# Altium schematic sheet PIC32.SchDoc: Carte mère embarquée - PIC32
size A3; Author: B Labbe; CompanyName: Oufffteam; DrawnBy: B Labbe; Engineer: B Labbe; Organization: Oufffteam; Address1: L3, 12a Rodborough Rd; Address2: Frenchs Forest; Address3: NSW; Address4: Australia 2086; Revision: A; SheetNumber: 3; SheetTotal: 6; DocumentName: Carte mère embarquée - PIC32
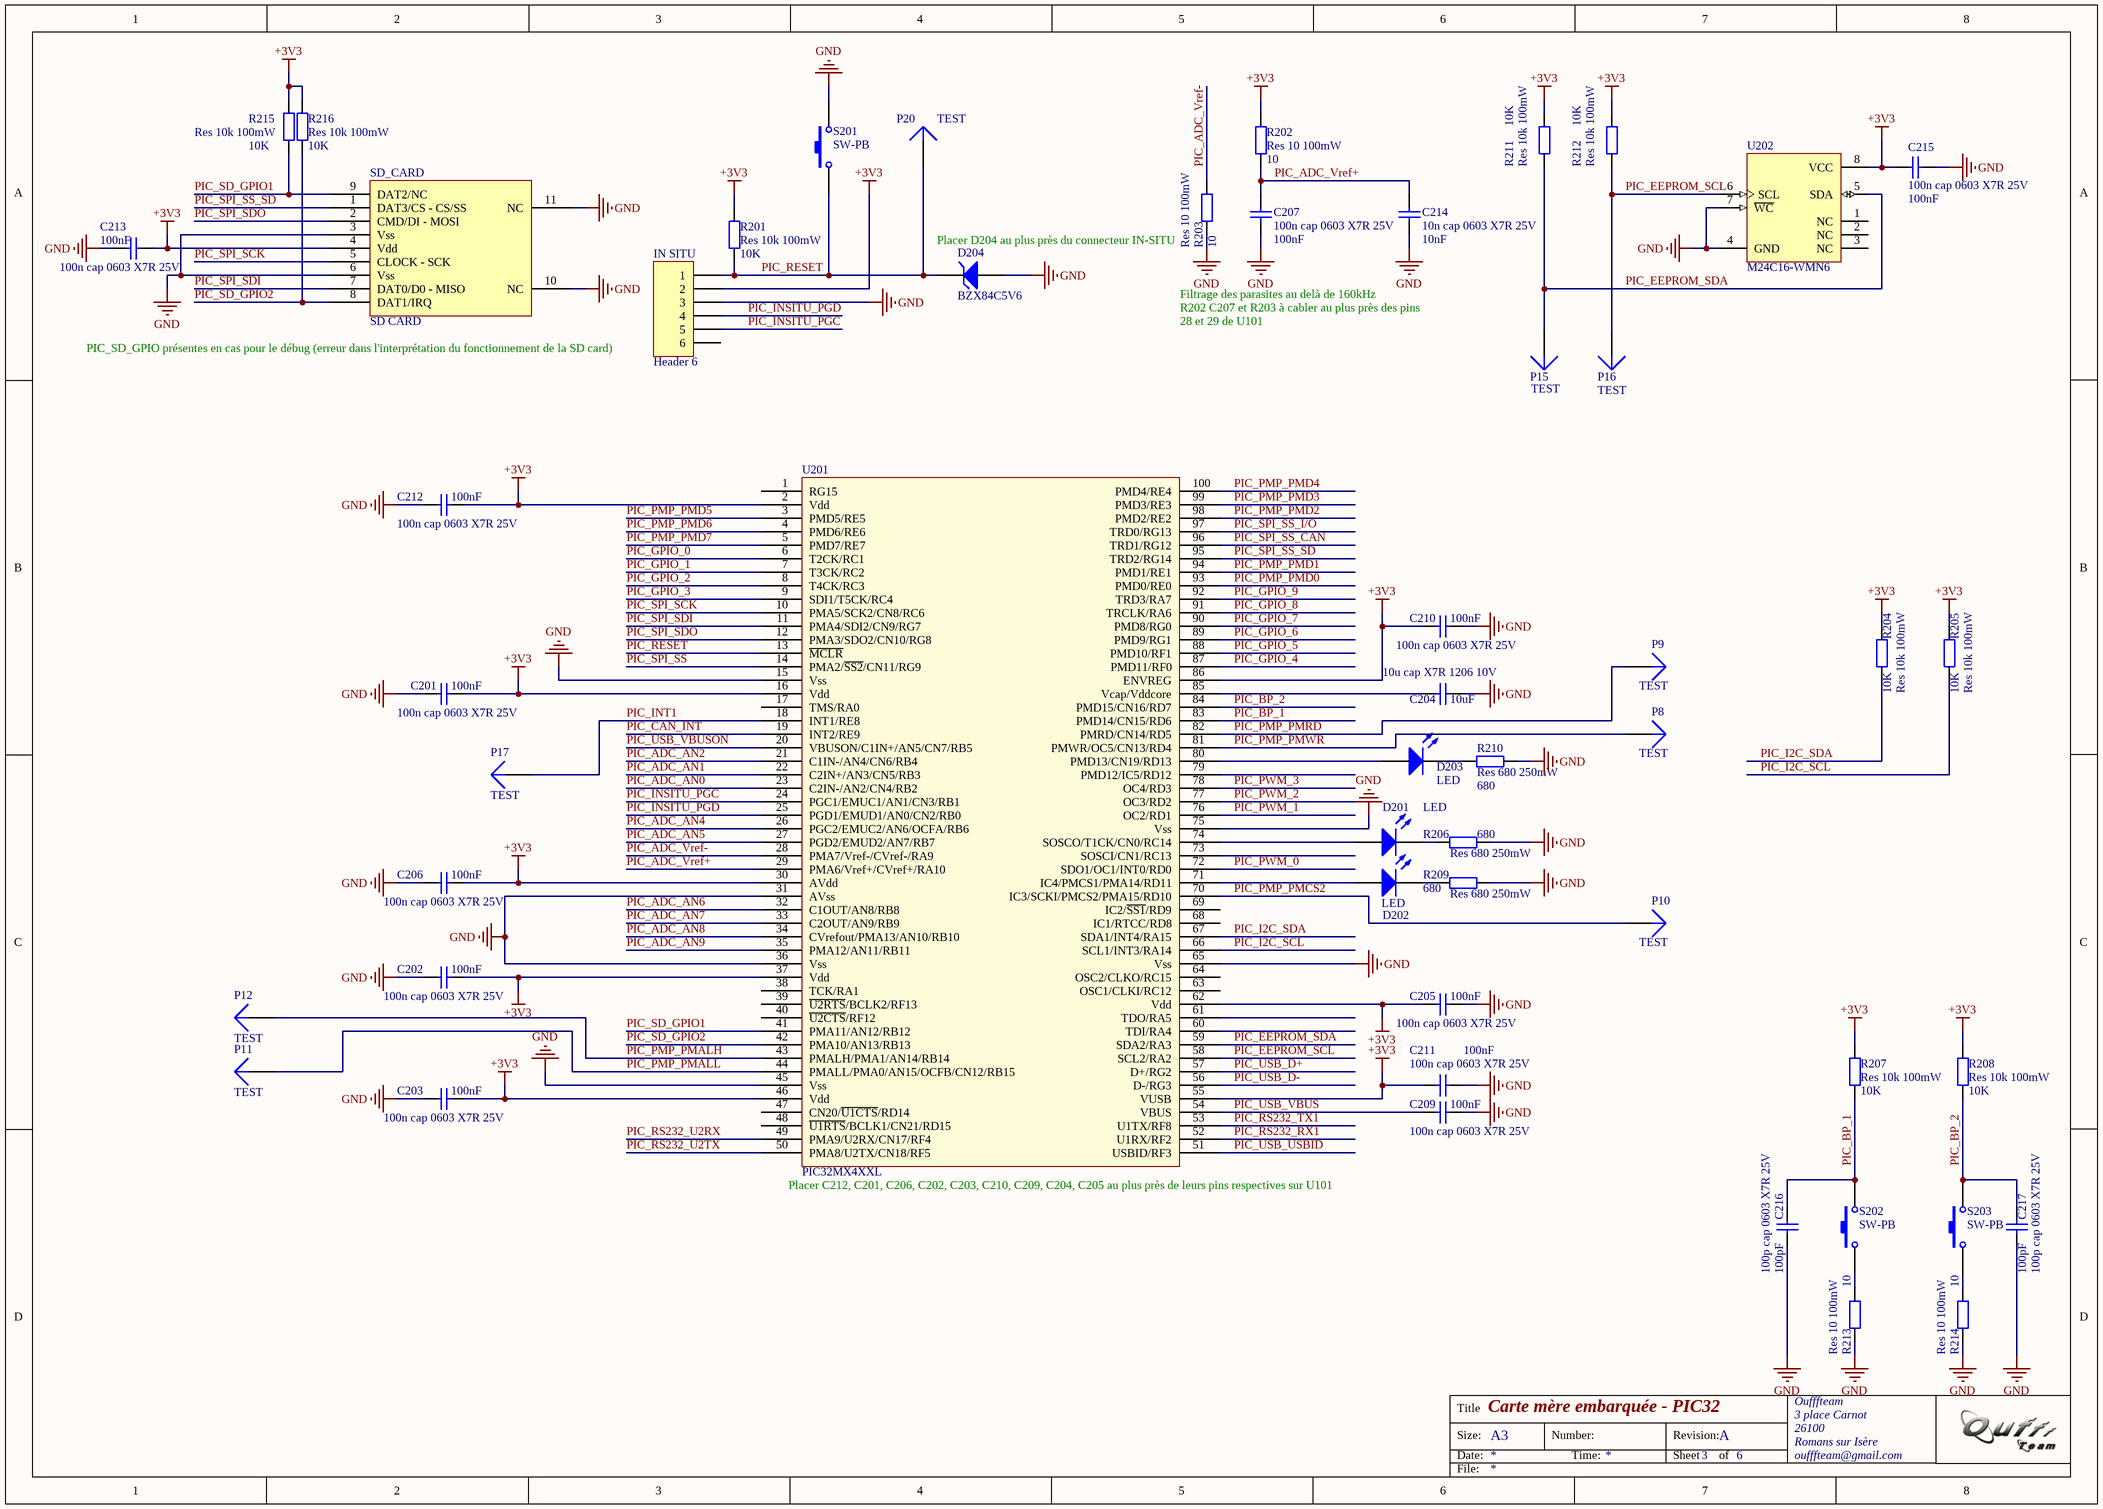
[diagram p0: PIC32.SchDoc]

## Parts
C201  100n cap 0603 X7R 25V  value 100nF  [1608[0603]]
C202  100n cap 0603 X7R 25V  value 100nF  [1608[0603]]
C203  100n cap 0603 X7R 25V  value 100nF  [1608[0603]]
C204  10u cap X7R 1206 10V  value 10uF  [3216[1206]]
C205  100n cap 0603 X7R 25V  value 100nF  [1608[0603]]
C206  100n cap 0603 X7R 25V  value 100nF  [1608[0603]]
C207  100n cap 0603 X7R 25V  value 100nF  [1608[0603]]
C209  100n cap 0603 X7R 25V  value 100nF  [1608[0603]]
C210  100n cap 0603 X7R 25V  value 100nF  [1608[0603]]
C211  100n cap 0603 X7R 25V  value 100nF  [1608[0603]]
C212  100n cap 0603 X7R 25V  value 100nF  [1608[0603]]
C213  100n cap 0603 X7R 25V  value 100nF  [1608[0603]]
C214  10n cap 0603 X7R 25V  value 10nF  [1608[0603]]
C215  100n cap 0603 X7R 25V  value 100nF  [1608[0603]]
C216  100p cap 0603 X7R 25V  value 100pF  [1608[0603]]
C217  100p cap 0603 X7R 25V  value 100pF  [1608[0603]]
D201  LED  [1608[0603]]
D202  LED  [1608[0603]]
D203  LED  [1608[0603]]
D204  BZX84C5V6  [318-07]
IN_SITU  Header 6  [HDR1X6]
P8  TEST  [TP1]
P9  TEST  [TP1]
P10  TEST  [TP1]
P11  TEST  [TP1]
P12  TEST  [TP1]
P15  TEST  [TP1]
P16  TEST  [TP1]
P17  TEST  [TP1]
P20  TEST  [TP1]
R201  Res 10k 100mW  value 10K  [1608[0603]]
R202  Res 10 100mW  value 10  [1608[0603]]
R203  Res 10 100mW  value 10  [1608[0603]]
R204  Res 10k 100mW  value 10K  [1608[0603]]
R205  Res 10k 100mW  value 10K  [1608[0603]]
R206  Res 680 250mW  value 680  [1608[0603]]
R207  Res 10k 100mW  value 10K  [1608[0603]]
R208  Res 10k 100mW  value 10K  [1608[0603]]
R209  Res 680 250mW  value 680  [1608[0603]]
R210  Res 680 250mW  value 680  [1608[0603]]
R211  Res 10k 100mW  value 10K  [1608[0603]]
R212  Res 10k 100mW  value 10K  [1608[0603]]
R213  Res 10 100mW  value 10  [1608[0603]]
R214  Res 10 100mW  value 10  [1608[0603]]
R215  Res 10k 100mW  value 10K  [1608[0603]]
R216  Res 10k 100mW  value 10K  [1608[0603]]
S201  SW-PB  [BP1]
S202  SW-PB  [BP1]
S203  SW-PB  [BP1]
SD_CARD  SD CARD  [SDHolder]
U201  PIC32MX4XXL  [TSQFP40P1400X1400X120-100N]
U202  M24C16-WMN6  [SOP8_N]

## Nets
+3V3: C201.2 C202.2 C203.2 C205.1 C206.2 C210.1 C211.1 C212.2 C213.2 C215.1 IN_SITU.2 R201.2 R202.2 R204.2 R205.2 R207.2 R208.2 R211.2 R212.2 R215.2 R216.2 SD_CARD.4(Vdd) U201.2(Vdd) U201.16(Vdd) U201.30(AVdd) U201.37(Vdd) U201.46(Vdd) U201.55(VUSB) U201.62(Vdd) U201.86(ENVREG) U202.8(VCC)
GND: C201.1 C202.1 C203.1 C204.2 C205.2 C206.1 C207.1 C209.2 C210.2 C211.2 C212.1 C213.1 C214.1 C215.2 C216.1 C217.1 D204.1(A) IN_SITU.3 R203.1 R206.2 R209.2 R210.2 R213.1 R214.1 S201.3 SD_CARD.3(Vss) SD_CARD.6(Vss) SD_CARD.10(NC) SD_CARD.11(NC) U201.15(Vss) U201.31(AVss) U201.36(Vss) U201.45(Vss) U201.65(Vss) U201.75(Vss) U202.4(GND) U202.7(~{WC})
PIC_ADC_AN0: U201.23(C2IN-/AN2/CN4/RB2)
PIC_ADC_AN1: U201.22(C2IN+/AN3/CN5/RB3)
PIC_ADC_AN2: U201.21(C1IN-/AN4/CN6/RB4)
PIC_ADC_AN4: U201.26(PGC2/EMUC2/AN6/OCFA/RB6)
PIC_ADC_AN5: U201.27(PGD2/EMUD2/AN7/RB7)
PIC_ADC_AN6: U201.32(C1OUT/AN8/RB8)
PIC_ADC_AN7: U201.33(C2OUT/AN9/RB9)
PIC_ADC_AN8: U201.34(CVrefout/PMA13/AN10/RB10)
PIC_ADC_AN9: U201.35(PMA12/AN11/RB11)
PIC_ADC_Vref+: C207.2 C214.2 R202.1 U201.29(PMA6/Vref+/CVref+/RA10)
PIC_ADC_Vref-: R203.2 U201.28(PMA7/Vref-/CVref-/RA9)
PIC_BP_1: C216.2 R207.1 S202.3 U201.83(PMD14/CN15/RD6)
PIC_BP_2: C217.2 R208.1 S203.3 U201.84(PMD15/CN16/RD7)
PIC_CAN_INT: U201.19(INT2/RE9)
PIC_EEPROM_SCL: P16.1 R212.1 U201.58(SCL2/RA2) U202.6(SCL)
PIC_EEPROM_SDA: P15.1 R211.1 U201.59(SDA2/RA3) U202.5(SDA)
PIC_GPIO_0: U201.6(T2CK/RC1)
PIC_GPIO_1: U201.7(T3CK/RC2)
PIC_GPIO_2: U201.8(T4CK/RC3)
PIC_GPIO_3: U201.9(SDI1/T5CK/RC4)
PIC_GPIO_4: U201.87(PMD11/RF0)
PIC_GPIO_5: U201.88(PMD10/RF1)
PIC_GPIO_6: U201.89(PMD9/RG1)
PIC_GPIO_7: U201.90(PMD8/RG0)
PIC_GPIO_8: U201.91(TRCLK/RA6)
PIC_GPIO_9: U201.92(TRD3/RA7)
PIC_I2C_SCL: R205.1 U201.66(SCL1/INT3/RA14)
PIC_I2C_SDA: R204.1 U201.67(SDA1/INT4/RA15)
PIC_INSITU_PGC: IN_SITU.5 U201.24(PGC1/EMUC1/AN1/CN3/RB1)
PIC_INSITU_PGD: IN_SITU.4 U201.25(PGD1/EMUD1/AN0/CN2/RB0)
PIC_INT1: P17.1 U201.18(INT1/RE8)
PIC_PMP_PMALH: P12.1 U201.43(PMALH/PMA1/AN14/RB14)
PIC_PMP_PMALL: P11.1 U201.44(PMALL/PMA0/AN15/OCFB/CN12/RB15)
PIC_PMP_PMCS2: P10.1 U201.70(IC3/SCKI/PMCS2/PMA15/RD10)
PIC_PMP_PMD0: U201.93(PMD0/RE0)
PIC_PMP_PMD1: U201.94(PMD1/RE1)
PIC_PMP_PMD2: U201.98(PMD2/RE2)
PIC_PMP_PMD3: U201.99(PMD3/RE3)
PIC_PMP_PMD4: U201.100(PMD4/RE4)
PIC_PMP_PMD5: U201.3(PMD5/RE5)
PIC_PMP_PMD6: U201.4(PMD6/RE6)
PIC_PMP_PMD7: U201.5(PMD7/RE7)
PIC_PMP_PMRD: P9.1 U201.82(PMRD/CN14/RD5)
PIC_PMP_PMWR: P8.1 U201.81(PMWR/OC5/CN13/RD4)
PIC_PWM_0: U201.72(SDO1/OC1/INT0/RD0)
PIC_PWM_1: U201.76(OC2/RD1)
PIC_PWM_2: U201.77(OC3/RD2)
PIC_PWM_3: U201.78(OC4/RD3)
PIC_RESET: D204.3(K) IN_SITU.1 P20.1 R201.1 S201.1 U201.13(~{MCLR})
PIC_RS232_RX1: U201.52(U1RX/RF2)
PIC_RS232_TX1: U201.53(U1TX/RF8)
PIC_RS232_U2RX: U201.49(PMA9/U2RX/CN17/RF4)
PIC_RS232_U2TX: U201.50(PMA8/U2TX/CN18/RF5)
PIC_SD_GPIO1: R215.1 SD_CARD.9(DAT2/NC) U201.41(PMA11/AN12/RB12)
PIC_SD_GPIO2: R216.1 SD_CARD.8(DAT1/IRQ) U201.42(PMA10/AN13/RB13)
PIC_SPI_SCK: SD_CARD.5(CLOCK_-_SCK) U201.10(PMA5/SCK2/CN8/RC6)
PIC_SPI_SDI: SD_CARD.7(DAT0/D0_-_MISO) U201.11(PMA4/SDI2/CN9/RG7)
PIC_SPI_SDO: SD_CARD.2(CMD/DI_-_MOSI) U201.12(PMA3/SDO2/CN10/RG8)
PIC_SPI_SS: U201.14(PMA2/~{SS2}/CN11/RG9)
PIC_SPI_SS_CAN: U201.96(TRD1/RG12)
PIC_SPI_SS_I/O: U201.97(TRD0/RG13)
PIC_SPI_SS_SD: SD_CARD.1(DAT3/CS_-_CS/SS) U201.95(TRD2/RG14)
PIC_USB_D+: U201.57(D+/RG2)
PIC_USB_D-: U201.56(D-/RG3)
PIC_USB_USBID: U201.51(USBID/RF3)
PIC_USB_VBUS: C209.1 U201.54(VBUS)
PIC_USB_VBUSON: U201.20(VBUSON/C1IN+/AN5/CN7/RB5)
NetC204_1: C204.1 U201.85(Vcap/Vddcore)
NetD201_1: D201.1(A) U201.74(SOSCO/T1CK/CN0/RC14)
NetD201_2: D201.2(K) R206.1
NetD202_1: D202.1(A) U201.71(IC4/PMCS1/PMA14/RD11)
NetD202_2: D202.2(K) R209.1
NetD203_1: D203.1(A) U201.80(PMD13/CN19/RD13)
NetD203_2: D203.2(K) R210.1
NetR213_2: R213.2 S202.1
NetR214_2: R214.2 S203.1

Not connected (* = marked no-connect by the designer): IN_SITU 6; U201 1(RG15) 17(TMS/RA0) 38(TCK/RA1) 39(~{U2RTS}/BCLK2/RF13) 40(~{U2CTS}/RF12) 47(CN20/~{U1CTS}/RD14) 48(~{U1RTS}/BCLK1/CN21/RD15) 60(TDI/RA4) 61(TDO/RA5) 63(OSC1/CLKI/RC12) 64(OSC2/CLKO/RC15) 68(IC1/RTCC/RD8) 69(IC2/~{SS1}/RD9) 73(SOSCI/CN1/RC13) 79(PMD12/IC5/RD12); U202 1(NC) 2(NC) 3(NC)

## Notes on the sheet
- (near R203) Placer D204 au plus près du connecteur IN-SITU
- Filtrage des parasites au delà de 160kHz
- R202 C207 et R203 à cabler au plus près des pins
- (near IN_SITU) PIC_SD_GPIO présentes en cas pour le débug (erreur dans l'interprétation du fonctionnement de la SD card)
- 28 et 29 de U101
- (near U201) Placer C212, C201, C206, C202, C203, C210, C209, C204, C205 au plus près de leurs pins respectives sur U101
- Title
- Size:
- Date:
- A3
- Number:
- Time:
- Revision:
- Sheet
- of
- Oufffteam
- 3 place Carnot
- 26100
- Romans sur Isère
- oufffteam@gmail.com
- File:

## Library data of the parts
C201-C207 C209-C217 = Cap: Capacitor; Published: 8-Jun-2000; LatestRevisionDate: 17-Jul-2002; LatestRevisionNote: Re-released for DXP Platform.; PackageReference: RAD-0.3; Publisher: Altium Limited
D201-D203 = LED0: LED SML-311DTT86; Published: 8-Jun-2000; LatestRevisionDate: 08-Jul-2005; LatestRevisionNote: Mech Layer 1 removed.; PackageReference: LED-0; Publisher: Altium Limited
D204 = BZX84C5V6LT1: Zener Voltage Regulator Diode; Note: Pin 2 is not connected and not drawn.; Published: 29-Sep-2000; LatestRevisionDate: 17-Jul-2002; LatestRevisionNote: Re-released for DXP Platform.; PackageReference: 318-07; Publisher: Altium Limited; PackageDescription: SOT-23; 3 Leads; Body 3.0 x 2.5 mm, inc. leads (LxW max); ComponentLink1Description: Manufacturer Link; ComponentLink1URL: http://www.onsemi.com/site/products/landing?taxonomyID=194; ComponentLink2Description: Datasheet; ComponentLink2URL: http://www.onsemi.com/pub/Collateral/BZX84C2V4LT1-D.PDF
IN_SITU = Header 6: Header, 6-Pin; LatestRevisionDate: 17-Jul-2002; LatestRevisionNote: Re-released for DXP Platform.; Publisher: Altium Limited
P8-P12 P15-P17 P20 = Plug: LatestRevisionDate: 17-Jul-2002; LatestRevisionNote: Re-released for DXP Platform.; Publisher: Altium Limited
R201-R216 = Res2: Resistor; Published: 8-Jun-2000; LatestRevisionDate: 17-Jul-2002; LatestRevisionNote: Re-released for DXP Platform.; PackageReference: AXIAL-0.4; Publisher: Altium Limited
S201-S203 = SW-PB: Switch; Published: 24-Mar-1999; LatestRevisionDate: 17-Jul-2002; LatestRevisionNote: Re-released for DXP Platform.; PackageReference: SPST-2; Publisher: Altium Limited
SD_CARD = SD CARD: SD Card Holder
U201 = PIC32MX4XXL: PIC32
U202 = M24C16MN6: 16Kbit Serial I²C Bus EEPROM; Published: 24-Aug-2001; LatestRevisionDate: 13-Apr-2006; LatestRevisionNote: IPC-7351 Footprint Added.; DatasheetVersion: Sep-1999; PackageVersion: Jul-1999; PackageReference: SOP8; Publisher: Altium Limited; PackageDescription: 8-Pin Small Outline Integrated Circuit 1.27 mm Pitch; ComponentLink1Description: Manufacturer Link; ComponentLink1URL: http://www.st.com/; ComponentLink2Description: Datasheet; ComponentLink2URL: http://www.st.com/stonline/products/literature/ds/5067/m24c01-r.pdf